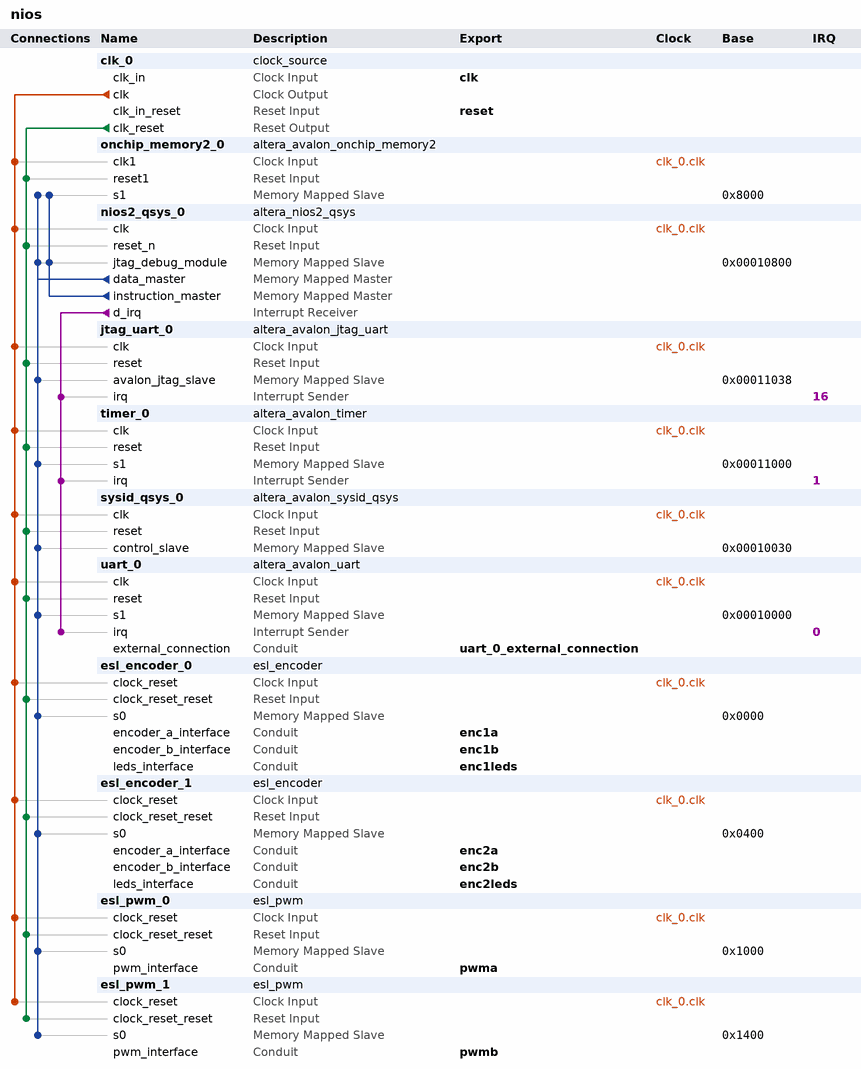
[diagram p0: system contents]
# Platform Designer (Qsys) system nios, Cyclone IV E EP4CE22F17C6
# Parameters at their usual value, and those the tool derives, are not listed.
package require -exact qsys 13.1
create_system nios
set_project_property DEVICE_FAMILY {Cyclone IV E}
set_project_property DEVICE EP4CE22F17C6

add_instance clk_0 clock_source 13.1
set_instance_parameter_value clk_0 clockFrequency 50000000

add_instance onchip_memory2_0 altera_avalon_onchip_memory2 13.1
set_instance_parameter_value onchip_memory2_0 dataWidth 32
set_instance_parameter_value onchip_memory2_0 dualPort false
set_instance_parameter_value onchip_memory2_0 initMemContent true
set_instance_parameter_value onchip_memory2_0 initializationFileName onchip_mem.hex
set_instance_parameter_value onchip_memory2_0 memorySize 32768

add_instance nios2_qsys_0 altera_nios2_qsys 13.1
set_instance_parameter_value nios2_qsys_0 resetSlave onchip_memory2_0.s1
set_instance_parameter_value nios2_qsys_0 mmu_TLBMissExcSlave None
set_instance_parameter_value nios2_qsys_0 exceptionSlave onchip_memory2_0.s1
set_instance_parameter_value nios2_qsys_0 breakSlave nios2_qsys_0.jtag_debug_module
set_instance_parameter_value nios2_qsys_0 impl Small
set_instance_parameter_value nios2_qsys_0 icache_size 2048

add_instance jtag_uart_0 altera_avalon_jtag_uart 13.1
set_instance_parameter_value jtag_uart_0 simInteractiveOptions NO_INTERACTIVE_WINDOWS

add_instance timer_0 altera_avalon_timer 13.1
set_instance_parameter_value timer_0 period 1
set_instance_parameter_value timer_0 periodUnits MSEC

add_instance sysid_qsys_0 altera_avalon_sysid_qsys 13.1
set_instance_parameter_value sysid_qsys_0 id 0

add_instance uart_0 altera_avalon_uart 13.1
set_instance_parameter_value uart_0 baud 115200
set_instance_parameter_value uart_0 dataBits 8
set_instance_parameter_value uart_0 fixedBaud true
set_instance_parameter_value uart_0 parity NONE
set_instance_parameter_value uart_0 stopBits 1

add_instance esl_encoder_0 esl_encoder 1.0
set_instance_parameter_value esl_encoder_0 DATA_WIDTH 32
set_instance_parameter_value esl_encoder_0 LED_WIDTH 8

add_instance esl_encoder_1 esl_encoder 1.0
set_instance_parameter_value esl_encoder_1 DATA_WIDTH 32
set_instance_parameter_value esl_encoder_1 LED_WIDTH 8

add_instance esl_pwm_0 esl_pwm 1.0
set_instance_parameter_value esl_pwm_0 DATA_WIDTH 32

add_instance esl_pwm_1 esl_pwm 1.0
set_instance_parameter_value esl_pwm_1 DATA_WIDTH 32

# connections
add_connection clk_0.clk esl_encoder_0.clock_reset clock
add_connection clk_0.clk esl_encoder_1.clock_reset clock
add_connection clk_0.clk esl_pwm_0.clock_reset clock
add_connection clk_0.clk esl_pwm_1.clock_reset clock
add_connection clk_0.clk jtag_uart_0.clk clock
add_connection clk_0.clk nios2_qsys_0.clk clock
add_connection clk_0.clk onchip_memory2_0.clk1 clock
add_connection clk_0.clk sysid_qsys_0.clk clock
add_connection clk_0.clk timer_0.clk clock
add_connection clk_0.clk uart_0.clk clock
add_connection clk_0.clk_reset esl_encoder_0.clock_reset_reset reset
add_connection clk_0.clk_reset esl_encoder_1.clock_reset_reset reset
add_connection clk_0.clk_reset esl_pwm_0.clock_reset_reset reset
add_connection clk_0.clk_reset esl_pwm_1.clock_reset_reset reset
add_connection clk_0.clk_reset jtag_uart_0.reset reset
add_connection clk_0.clk_reset nios2_qsys_0.reset_n reset
add_connection clk_0.clk_reset onchip_memory2_0.reset1 reset
add_connection clk_0.clk_reset sysid_qsys_0.reset reset
add_connection clk_0.clk_reset timer_0.reset reset
add_connection clk_0.clk_reset uart_0.reset reset
add_connection nios2_qsys_0.data_master esl_encoder_0.s0 avalon
set_connection_parameter_value nios2_qsys_0.data_master/esl_encoder_0.s0 baseAddress 0x0000
add_connection nios2_qsys_0.data_master esl_encoder_1.s0 avalon
set_connection_parameter_value nios2_qsys_0.data_master/esl_encoder_1.s0 baseAddress 0x0400
add_connection nios2_qsys_0.data_master esl_pwm_0.s0 avalon
set_connection_parameter_value nios2_qsys_0.data_master/esl_pwm_0.s0 baseAddress 0x1000
add_connection nios2_qsys_0.data_master esl_pwm_1.s0 avalon
set_connection_parameter_value nios2_qsys_0.data_master/esl_pwm_1.s0 baseAddress 0x1400
add_connection nios2_qsys_0.data_master jtag_uart_0.avalon_jtag_slave avalon
set_connection_parameter_value nios2_qsys_0.data_master/jtag_uart_0.avalon_jtag_slave baseAddress 0x00011038
add_connection nios2_qsys_0.data_master nios2_qsys_0.jtag_debug_module avalon
set_connection_parameter_value nios2_qsys_0.data_master/nios2_qsys_0.jtag_debug_module baseAddress 0x00010800
add_connection nios2_qsys_0.data_master onchip_memory2_0.s1 avalon
set_connection_parameter_value nios2_qsys_0.data_master/onchip_memory2_0.s1 baseAddress 0x8000
add_connection nios2_qsys_0.data_master sysid_qsys_0.control_slave avalon
set_connection_parameter_value nios2_qsys_0.data_master/sysid_qsys_0.control_slave baseAddress 0x00010030
add_connection nios2_qsys_0.data_master timer_0.s1 avalon
set_connection_parameter_value nios2_qsys_0.data_master/timer_0.s1 baseAddress 0x00011000
add_connection nios2_qsys_0.data_master uart_0.s1 avalon
set_connection_parameter_value nios2_qsys_0.data_master/uart_0.s1 baseAddress 0x00010000
add_connection nios2_qsys_0.instruction_master nios2_qsys_0.jtag_debug_module avalon
set_connection_parameter_value nios2_qsys_0.instruction_master/nios2_qsys_0.jtag_debug_module baseAddress 0x00010800
add_connection nios2_qsys_0.instruction_master onchip_memory2_0.s1 avalon
set_connection_parameter_value nios2_qsys_0.instruction_master/onchip_memory2_0.s1 baseAddress 0x8000
add_connection nios2_qsys_0.d_irq jtag_uart_0.irq interrupt
set_connection_parameter_value nios2_qsys_0.d_irq/jtag_uart_0.irq irqNumber 16
add_connection nios2_qsys_0.d_irq timer_0.irq interrupt
set_connection_parameter_value nios2_qsys_0.d_irq/timer_0.irq irqNumber 1
add_connection nios2_qsys_0.d_irq uart_0.irq interrupt
set_connection_parameter_value nios2_qsys_0.d_irq/uart_0.irq irqNumber 0

# exported interfaces
add_interface clk clock sink
set_interface_property clk EXPORT_OF clk_0.clk_in
add_interface reset reset sink
set_interface_property reset EXPORT_OF clk_0.clk_in_reset
add_interface uart_0_external_connection conduit end
set_interface_property uart_0_external_connection EXPORT_OF uart_0.external_connection
add_interface enc1a conduit end
set_interface_property enc1a EXPORT_OF esl_encoder_0.encoder_a_interface
add_interface enc1b conduit end
set_interface_property enc1b EXPORT_OF esl_encoder_0.encoder_b_interface
add_interface enc2a conduit end
set_interface_property enc2a EXPORT_OF esl_encoder_1.encoder_a_interface
add_interface enc2b conduit end
set_interface_property enc2b EXPORT_OF esl_encoder_1.encoder_b_interface
add_interface enc1leds conduit end
set_interface_property enc1leds EXPORT_OF esl_encoder_0.leds_interface
add_interface enc2leds conduit end
set_interface_property enc2leds EXPORT_OF esl_encoder_1.leds_interface
add_interface pwma conduit end
set_interface_property pwma EXPORT_OF esl_pwm_0.pwm_interface
add_interface pwmb conduit end
set_interface_property pwmb EXPORT_OF esl_pwm_1.pwm_interface

set_interconnect_requirement {$system} qsys_mm.clockCrossingAdapter HANDSHAKE
set_interconnect_requirement {$system} qsys_mm.maxAdditionalLatency 1
set_interconnect_requirement {$system} qsys_mm.insertDefaultSlave false

save_system nios.qsys
